# Altium project c1yc_ldm.PrjPcb
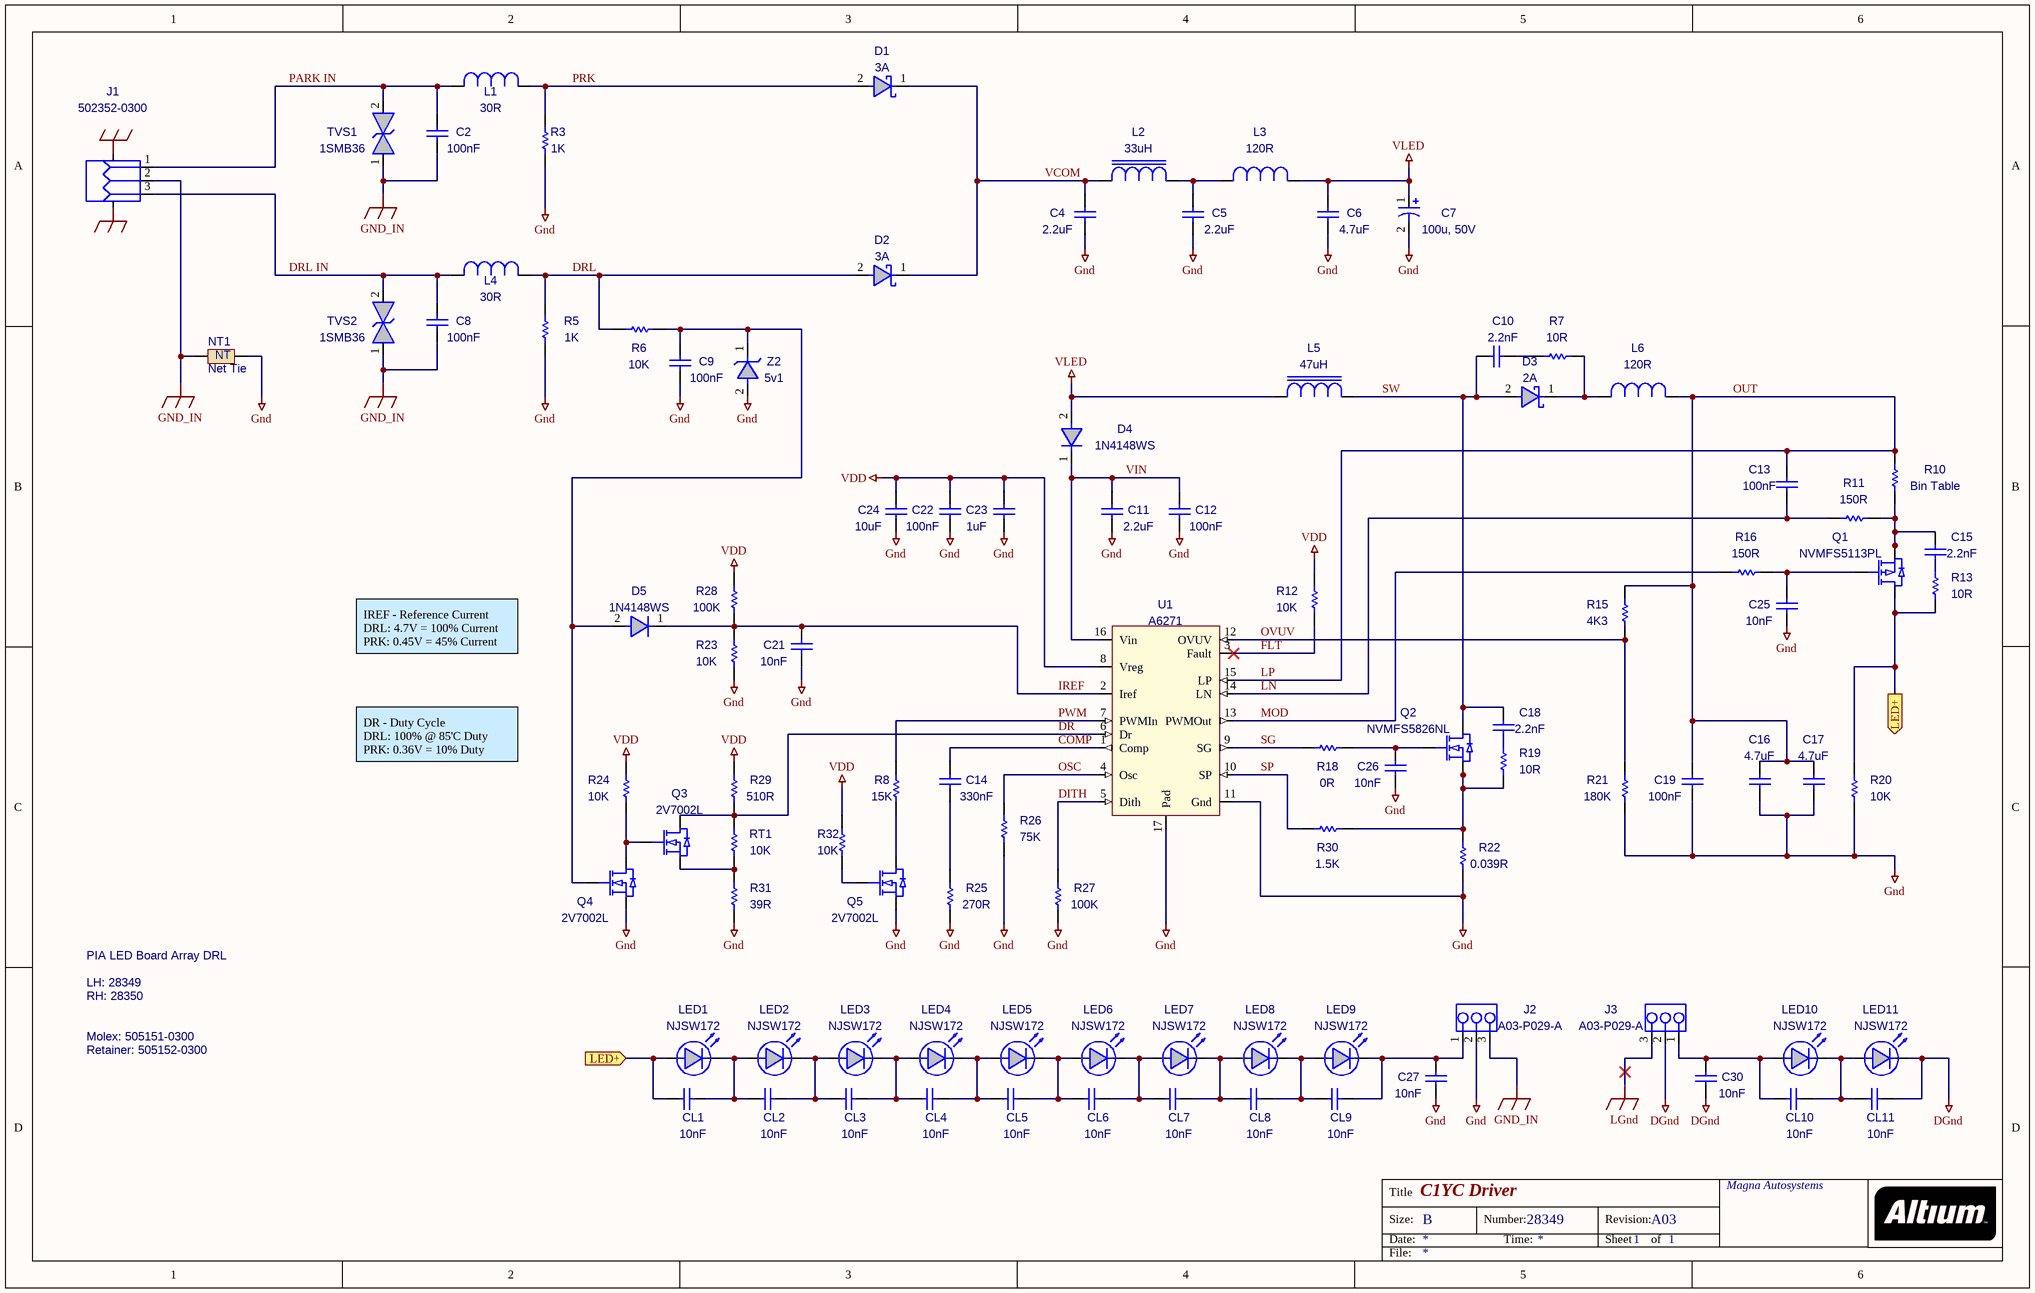
[diagram p0: c1yc_ldm.SchDoc]
PartAssembly: LitMock Assy; PartName: C1YC HDLP; PartNumber: 28349 Assy; PartPCB: 28349; PartRevision: A03
1 sheet, 98 parts. Net scope: flat (ports and power ports of the same name join across sheets).
Board file: c1yc_ldm.PcbDoc

## Sheet c1yc_ldm.SchDoc: C1YC Driver
size B; Author: Ashley Preston; DocumentNumber: 28349; Revision: A03; SheetNumber: 1; SheetTotal: 1; CompanyName: Magna Autosystems; DrawnBy: Ashley Preston; Organization: Magna Autosystems; DocumentName: C1YC Driver; ProjectName: C1YC HDLP

### Parts
C2  100nF  [CAPC0603(1608)100_N]
C4  2.2uF  [CAPC1210(3225)230_N]
C5  2.2uF  [CAPC1210(3225)230_N]
C6  4.7uF  [CAPC1210(3225)280_N]
C7  100u, 50V  [146CT1 Series 1010]
C8  100nF  [CAPC0603(1608)100_N]
C9  100nF  [CAPC0603(1608)100_N]
C10  2.2nF  [CAPC0603(1608)100_N]
C11  2.2uF  [CAPC1210(3225)230_N]
C12  100nF  [CAPC0603(1608)100_N]
C13  100nF  [CAPC0603(1608)100_N]
C14  330nF  [CAPC0603(1608)100_N]
C15  2.2nF  [CAPC0603(1608)100_N]
C16  4.7uF  [CAPC1210(3225)280_N]
C17  4.7uF  [CAPC1210(3225)280_N]
C18  2.2nF  [CAPC0603(1608)100_N]
C19  100nF  [CAPC0603(1608)100_N]
C21  10nF  [CAPC0603(1608)100_N]
C22  100nF  [CAPC0603(1608)100_N]
C23  1uF  [CAPC0603(1608)100_N]
C24  10uF  [CAPC1206(3216)190_L]
C25  10nF  [CAPC0603(1608)100_N]
C26  10nF  [CAPC0603(1608)100_N]
C27  10nF  [CAPC0603(1608)100_N]
C30  10nF  [CAPC0603(1608)100_N]
CL1  10nF  [CAPC0603(1608)100_N]
CL2  10nF  [CAPC0603(1608)100_N]
CL3  10nF  [CAPC0603(1608)100_N]
CL4  10nF  [CAPC0603(1608)100_N]
CL5  10nF  [CAPC0603(1608)100_N]
CL6  10nF  [CAPC0603(1608)100_N]
CL7  10nF  [CAPC0603(1608)100_N]
CL8  10nF  [CAPC0603(1608)100_N]
CL9  10nF  [CAPC0603(1608)100_N]
CL10  10nF  [CAPC0603(1608)100_N]
CL11  10nF  [CAPC0603(1608)100_N]
D1  3A  [NRVBS3]
D2  3A  [NRVBS3]
D3  2A  [OnSemi SMB Case 403A-03]
D4  1N4148WS  [SOD323F]
D5  1N4148WS  [SOD323F]
J1  502352-0300  [502352-0300]
J2  A03-P029-A  [A03-P029-A]
J3  A03-P029-A  [A03-P029-A]
L1  30R  [BLM21PG]
L2  33uH  [CDRH127/L125]
L3  120R  [BLM21PG]
L4  30R  [BLM21PG]
L5  47uH  [CDRH127/L125]
L6  120R  [BLM21PG]
LED1  NJSW172  [NJSW172]
LED2  NJSW172  [NJSW172]
LED3  NJSW172  [NJSW172]
LED4  NJSW172  [NJSW172]
LED5  NJSW172  [NJSW172]
LED6  NJSW172  [NJSW172]
LED7  NJSW172  [NJSW172]
LED8  NJSW172  [NJSW172]
LED9  NJSW172  [NJSW172]
LED10  NJSW172  [NJSW172]
LED11  NJSW172  [NJSW172]
NT1  Net Tie  [Net_Tie_SMT_1mm]  (net tie, no BOM)
Q1  NVMFS5113PL  [ONSEMI DFN5 5x6 CASE 488AA Issue H]
Q2  NVMFS5826NL  [ONSEMI DFN5 5x6 CASE 488AA Issue H]
Q3  2V7002L  [OnSemi SOT-23 Case 318-08 Issue AP]
Q4  2V7002L  [OnSemi SOT-23 Case 318-08 Issue AP]
Q5  2V7002L  [OnSemi SOT-23 Case 318-08 Issue AP]
R3  1K  [RESC1206(3216)_N]
R5  1K  [RESC1206(3216)_N]
R6  10K  [RESC0603(1608)_N]
R7  10R  [RESC0603(1608)_N]
R8  15K  [RESC0603(1608)_N]
R10  Bin Table  [RESC0805(2012)_N]
R11  150R  [RESC0603(1608)_N]
R12  10K  [RESC0603(1608)_N]
R13  10R  [RESC0603(1608)_N]
R15  4K3  [RESC0603(1608)_N]
R16  150R  [RESC0603(1608)_N]
R18  0R  [RESC0603(1608)_N]
R19  10R  [RESC0603(1608)_N]
R20  10K  [RESC0603(1608)_N]
R21  180K  [RESC0603(1608)_N]
R22  0.039R  [RESC0805(2012)_N]
R23  10K  [RESC0603(1608)_N]
R24  10K  [RESC0603(1608)_N]
R25  270R  [RESC0603(1608)_N]
R26  75K  [RESC0603(1608)_N]
R27  100K  [RESC0603(1608)_N]
R28  100K  [RESC0603(1608)_N]
R29  510R  [RESC0603(1608)_N]
R30  1.5K  [RESC0603(1608)_N]
R31  39R  [RESC0603(1608)_N]
R32  10K  [RESC0603(1608)_N]
RT1  10K  [RESC0603(1608)_N]
TVS1  1SMB36  [OnSemi SMB Case 403C-01]
TVS2  1SMB36  [OnSemi SMB Case 403C-01]
U1  A6271  [A6268_LP]
Z2  5v1  [MM3Z]

### Ports
LED+ (in), LED+ (out)

### Nets
DGnd: C30.1 CL11.1 J3.2 LED11.1(Cathode)
Gnd: C4.1 C5.1 C6.1 C7.2(-) C9.1 C11.1 C12.1 C16.1 C17.1 C19.1 C21.1 C22.1 C23.1 C24.1 C25.1 C26.1 C27.1 J2.2 NT1.2 Q4.2(S) Q5.2(S) R3.1 R5.1 R20.1 R21.1 R22.1 R23.1 R25.1 R26.1 R27.1 R31.1 U1.11(Gnd) U1.17(Pad) Z2.2
GND_IN: C2.1 C8.1 J1.2 J1.4 J1.5 J2.3 NT1.1 TVS1.1 TVS2.1
LGnd: J3.3
VDD: C22.2 C23.2 C24.2 R12.2 R24.2 R28.2 R29.2 R32.2 U1.8(Vreg)
VLED: C6.2 C7.1(+) D4.2 L3.1 L5.2
COMP: C14.2 U1.1(Comp)
DITH: R27.2 U1.5(Dith)
DR: Q3.3(D) R29.1 RT1.2 U1.6(Dr)
DRL: D2.2(A) L4.1 R5.2 R6.2
DRL IN: C8.2 J1.3 L4.2 TVS2.2
FLT: R12.1 U1.3(Fault)
IREF: C21.2 D5.1 R23.2 R28.1 U1.2(Iref)
LN: C13.1 R11.1 U1.14(LN)
LP: C13.2 C16.2 C17.2 C19.2 L6.1 R10.2 R15.2 U1.15(LP)  [also labelled OUT]
MOD: R16.1 U1.13(PWMOut)
OSC: R26.2 U1.4(Osc)
OVUV: R15.1 R21.2 U1.12(OVUV)
PARK IN: C2.2 J1.1 L1.2 TVS1.2
PRK: D1.2(A) L1.1 R3.2
PWM: R8.2 U1.7(PWMIn)
SG: R18.1 U1.9(SG)
SP: R30.1 U1.10(SP)
SW: C10.2 C18.1 D3.2(A) L5.1 Q2.5(D)
VCOM: C4.2 D1.1(C) D2.1(C) L2.2
VIN: C11.2 C12.2 D4.1 U1.16(Vin)
NetC5_2: C5.2 L2.1 L3.2
NetC9_2: C9.2 D5.2 Q4.1(G) R6.1 Z2.1
NetC10_1: C10.1 R7.2
NetC14_1: C14.1 R25.2
NetC15_1: C15.1 Q1.1(S) Q1.2(S) Q1.3(S) R10.1 R11.2
NetC15_2: C15.2 R13.1
NetC18_2: C18.2 R19.1
NetC25_2: C25.2 Q1.4(G) R16.2
NetC26_2: C26.2 Q2.4(G) R18.2
NetC27_2: C27.2 CL9.1 J2.1 LED9.1(Cathode)
NetC30_2: C30.2 CL10.2 J3.1 LED10.2(Anode)
NetCL1_1: CL1.1 CL2.2 LED1.1(Cathode) LED2.2(Anode)
NetCL1_2: CL1.2 LED1.2(Anode) Q1.5(D) R13.2 R20.2 ; port LED+
NetCL2_1: CL2.1 CL3.2 LED2.1(Cathode) LED3.2(Anode)
NetCL3_1: CL3.1 CL4.2 LED3.1(Cathode) LED4.2(Anode)
NetCL4_1: CL4.1 CL5.2 LED4.1(Cathode) LED5.2(Anode)
NetCL5_1: CL5.1 CL6.2 LED5.1(Cathode) LED6.2(Anode)
NetCL6_1: CL6.1 CL7.2 LED6.1(Cathode) LED7.2(Anode)
NetCL7_1: CL7.1 CL8.2 LED7.1(Cathode) LED8.2(Anode)
NetCL8_1: CL8.1 CL9.2 LED8.1(Cathode) LED9.2(Anode)
NetCL10_1: CL10.1 CL11.2 LED10.1(Cathode) LED11.2(Anode)
NetD3_1: D3.1(C) L6.2 R7.1
NetQ2_1: Q2.1(S) Q2.2(S) Q2.3(S) R19.2 R22.2 R30.2
NetQ3_1: Q3.1(G) Q4.3(D) R24.1
NetQ3_2: Q3.2(S) R31.2 RT1.1
NetQ5_1: Q5.1(G) R32.1
NetQ5_3: Q5.3(D) R8.1

### Notes on the sheet
- IREF - Reference Current
  DRL: 4.7V = 100% Current
  PRK: 0.45V = 45% Current
- DR - Duty Cycle
  DRL: 100% @ 85'C Duty
  PRK: 0.36V = 10% Duty
- PIA LED Board Array DRL
- LH: 28349
- RH: 28350
- Molex: 505151-0300
- Retainer: 505152-0300
- Title
- Size:
- Date:
- B
- Number:
- Time:
- Revision:
- Sheet
- of
- File:
- (in symbol Net_Tie) NT

### Library data of the parts
C2 C8 C9 C12 C13 = CMP-1035-02592-1: CAP 100nF 50V ±10% 0603 (1608 Metric) Thickness 1mm SMD; Case-Metric: 1608; Case-EIA: 0603; AS P/N: ASC_100N_0603; Value: 100nF; Tolerance: ±10%
C4 C5 C11 = CMP-1038-02095-1: CAP 2.2uF 35V ±20% 1210 (3225 Metric) Thickness 2.3mm SMD; Case-Metric: 3225; Case-EIA: 1210; AS P/N: ASC_2U20_1210; Value: 2.2uF; Tolerance: ±20%
C6 C16 C17 = CMP-1038-02162-1: CAP 4.7uF 50V ±10% 1210 (3225 Metric) Thickness 2.8mm SMD; Case-Metric: 3225; Case-EIA: 1210; AS P/N: ASC_4U70_1210; Value: 4.7uF; Tolerance: ±10%; Rated Voltage: 50 V; Technology: SMT; Max Thickness: 2.8 mm
C7 = Cap_Electro_Vishay: CAP ALUM 100UF 50V 20% SMD 1010; AS P/N: ASC_100U_AL50
C10 C15 C18 = CMP-1035-02039-1: CAP 2.2nF 50V ±10% 0603 (1608 Metric) Thickness 1mm SMD; Case-Metric: 1608; Case-EIA: 0603; AS P/N: ASC_2N20_0603; Value: 2.2nF; Tolerance: ±10%
C14 = CMP-1035-02321-1: CAP330nF 50V ±10% 0603 (1608 Metric) Thickness 1mm SMD; Case-Metric: 1608; Case-EIA: 0603; AS P/N: ASC_330N_0603; Value: 330nF; Tolerance: ±10%
C19 C22 = CMP-1035-02592-1: CAP 100nF 50V ±10% 0603 (1608 Metric) Thickness 1mm SMD; Case-EIA: 0603; Case-Metric: 1608; AS P/N: ASC_100N_0603; Value: 100nF; Tolerance: ±10%
C21 C25-C27 C30 CL1-CL11 = CMP-1035-02321-1: CAP 10nF 50V ±10% 0603 (1608 Metric) Thickness 1mm SMD; Case-Metric: 1608; Case-EIA: 0603; AS P/N: ASC_10N0_0603; Value: 10nF; Tolerance: ±10%
C23 = CMP-1035-02706-1: CAP 1uF 35V ±10% 0603 (1608 Metric) Thickness 1mm SMD; Case-EIA: 0603; Rated Voltage: 16 V; Case-Metric: 1608; AS P/N: ASC_1U00_0603; Tolerance: ±10%; Max Thickness: 1 mm; Technology: SMT; Value: 1uF
C24 = CMP-1037-04974-1: CAP 10uF 16V ±10% 1206 (3216 Metric) Thickness 1.9mm SMD; Case-EIA: 1206; Case-Metric: 3216; AS P/N: ASC_10U0_1206; Rated Voltage: 16 V; Max Thickness: 1.9 mm; Value: 10uF; Tolerance: ±10%; Technology: SMT
D1 D2 = NRVBS3: AS P/N: NRVBS3; ClassName: DualFootprintDiode
D3 = NBRS2H: AS P/N: NBRS2H
J1 = 502352-0300: Duraclik header, right angle SMT, 3 circuits; AS P/N: 502352-0300
J2 J3 = A03-P029-A: Panta 3 pin flex ribbon; AS P/N: A03-P029-A
L1 L4 = BLM21PG300: Ferrite chip, 4A, 20ohm at 100 MHz, 0805 size; AS P/N: BLM21PG300
L2 = CDRH127/L125-33u: Power Inductor; AS P/N: DRA127-33
L3 L6 = BLM21PG121: Ferrite chip, 3.0A, 120ohm at 100 MHz, 0805 size; AS P/N: BLM21PG121
L5 = CDRH127/L125-47u: Power Inductor; AS P/N: DRA127-47
LED1-LED11 = NJSW172: Nichia White LED; ModifyDate: 11/19/2010 06:25:10; Value: *; AS P/N: NJSW172
NT1 = Net_Tie
Q1 = NVMFS5113PL: P Channel Mosfet, 60V, 64A; AS P/N: NVMFS5113PL
Q2 = NVMFS5826NL: N Channel Mosfet, 60V, 26A; AS P/N: NVMFS5826NL
Q3-Q5 = 2V7002L: N Channel Mosfet, 60V, 100mA; AS P/N: 2V7002L
R3 R5 = CMP-1014-00510-1: 1K 0.25W 1% 1206 (3216 Metric)  SMD; Value: 1000.00 Ohm; Case-Metric: 3216; Case-EIA: 1206; AS P/N: ASR_1K00_1206; Tolerance: 1 %; Power: 0.25 W; Technology: SMT
R6 R12 R20 R23 R24 R32 = CMP-1012-00623-1: 10K 0.1W 1% 0603 (1608 Metric)  SMD; Value: 10000.00 Ohm; Case-EIA: 0603; Case-Metric: 1608; AS P/N: ASR_10K0_0603; Tolerance: 1 %
R7 = CMP-1012-00284-1: 10R 0.1W 1% 0603 (1608 Metric)  SMD; Case-Metric: 1608; Case-EIA: 0603; AS P/N: ASR_10R0_0603; Value: 10R; Tolerance: 1 %
R8 = CMP-1012-00623-1: 15K 0.1W 1% 0603 (1608 Metric)  SMD; Value: 15000.00 Ohm; Case-EIA: 0603; Case-Metric: 1608; AS P/N: ASR_15K0_0603; Tolerance: 1 %
R10 = CMP-1013-00001-1: Jumper 0805 (2012 Metric); Case-EIA: 0805; Tolerance: None; Case-Metric: 2012; AS P/N: ASR_BIN_0805; Technology: SMT; Power: None
R11 R16 = CMP-1012-00415-1: 150R 0.1W 1% 0603 (1608 Metric)  SMD; Value: 150.00 Ohm; Case-EIA: 0603; Case-Metric: 1608; AS P/N: ASR_150R_0603; Technology: SMT; Tolerance: 1 %; Power: 0.1 W
R13 R19 = CMP-1012-00284-1: 10R 0.1W 1% 0603 (1608 Metric)  SMD; Value: 10.00 Ohm; Case-Metric: 1608; Case-EIA: 0603; AS P/N: ASR_10R0_0603; Tolerance: 1 %
R15 = CMP-1012-00623-1: 4K3 0.1W 1% 0603 (1608 Metric)  SMD; Value: 4300.00 Ohm; Case-EIA: 0603; Case-Metric: 1608; AS P/N: ASR_4K30_0603; Tolerance: 1 %
R18 = CMP-1012-00415-1: 0R 0.1W 1% 0603 (1608 Metric)  SMD; Value: 0 Ohm; Case-EIA: 0603; Case-Metric: 1608; AS P/N: ASR_0R00_0603; Technology: SMT; Tolerance: 1 %; Power: 0.1 W
R21 = CMP-1012-00623-1: 180K 0.1W 1% 0603 (1608 Metric)  SMD; Value: 180000.00 Ohm; Case-EIA: 0603; Case-Metric: 1608; AS P/N: ASR_180K_0603; Tolerance: 1 %
R22 = CMP-1013-00001-1: Jumper 0805 (2012 Metric); Case-EIA: 0805; Value: 0.039; Tolerance: None; Case-Metric: 2012; AS P/N: ASR_R039_0805; Technology: SMT; Power: None
R25 = CMP-1012-00623-1: 270R 0.1W 1% 0603 (1608 Metric)  SMD; Value: 270.00 Ohm; Case-EIA: 0603; Case-Metric: 1608; AS P/N: ASR_270R_0603; Tolerance: 1 %
R26 = CMP-1012-00712-1: 75K 0.1W 1% 0603 (1608 Metric)  SMD; Value: 75000.00 Ohm; Case-EIA: 0603; Case-Metric: 1608; AS P/N: ASR_75K0_0603; Technology: SMT; Tolerance: 1 %; Power: 0.1 W
R27 = CMP-1012-00712-1: 62K 0.1W 1% 0603 (1608 Metric)  SMD; Value: 62000.00 Ohm; Case-EIA: 0603; Case-Metric: 1608; AS P/N: ASR_100K_0603; Technology: SMT; Tolerance: 1 %; Power: 0.1 W
R28 = CMP-1012-00623-1: 100K 0.1W 1% 0603 (1608 Metric)  SMD; Value: 100000.00 Ohm; Case-EIA: 0603; Case-Metric: 1608; AS P/N: ASR_100K_0603; Tolerance: 1 %
R29 = CMP-1012-00623-1: 510R 0.1W 1% 0603 (1608 Metric)  SMD; Value: 510 Ohm; Case-EIA: 0603; Case-Metric: 1608; AS P/N: ASR_510R_0603; Tolerance: 1 %
R30 = CMP-1012-00415-1: 1.5K 0.1W 1% 0603 (1608 Metric)  SMD; Value: 1500.00 Ohm; Case-EIA: 0603; Case-Metric: 1608; AS P/N: ASR_1K50_0603; Technology: SMT; Tolerance: 1 %; Power: 0.1 W
R31 = CMP-1012-00623-1: 39R 0.1W 1% 0603 (1608 Metric)  SMD; Value: 39 Ohm; Case-EIA: 0603; Case-Metric: 1608; AS P/N: ASR_39R0_0603; Tolerance: 1 %
RT1 = CMP-1012-00623-1: 10K 0.1W 1% 0603 Thermistor; Case-EIA: 0603; Case-Metric: 1608; Value: 10000.00 Ohm; AS P/N: AST_10K0_0603; Tolerance: 1 %
TVS1 TVS2 = 1SMB36: TVS 600W, 36V; AS P/N: 1SMB36
U1 = A6271: High Current LED Buck Boost Controller; AS P/N: A6271
Z2 = MM3Z5V1: Zener Diode, SOD323, 5.1v, 200 mW; AS P/N: MM3Z5V1
D4 D5 = 1N4148WS: ModifyDate: 11/19/2010 06:25:12; AS P/N: 1N4148WS

## Assembly variants
Build: not fitted C1 C3 C26 CL1 CL2 CL3 CL4 CL5 CL6 CL7 P1 P2 R1 R2 R4 R14 R17 U2 Z1
Bare: not fitted C1 C2 C3 C4 C5 C6 C7 C8 C9 C10 C11 C12 C13 C14 C15 C16 C17 C18 C19 C21 C22 C23 C24 C25 C26 C27 C29 C30 CL1 CL2 CL3 CL4 CL5 CL6 CL7 CL8 CL9 CL10 CL11 D1 D2 D3 D4 D5 J1 J2 J3 L1 L2 L3 L4 L5 L6 LED1 LED2 LED3 LED4 LED5 LED6 LED7 LED8 LED9 LED10 LED11 NT1 P1 P2 Q1 Q2 Q3 Q4 R1 R2 R3 R4 R5 R6 R7 R8 R9 R10 R11 R12 R13 R14 R15 R16 R17 R18 R19 R20 R21 R22 R23 R24 R25 R26 R27 R28 R29 R30 R31 RT1 TVS1 TVS2 U1 U2 Z1 Z2
Full: all parts fitted
Adv Cir: not fitted CL1 CL2 CL3 CL4 CL5 CL6 CL7 J1 J2 LED1 LED2 LED3 LED4 LED5 LED6 LED7 P2 R11